# Altium schematic sheet power.SchDoc: Test
size A4; DrawnBy: Łukasz Przeniosło; Organization: Zachodniopomorski; Address1: Uniwersytet Technologiczny; Address2: w Szczecinie; Address3: Wydział Elektryczny; DocumentNumber: 8; Revision: 1.0; SheetNumber: 8; SheetTotal: 8
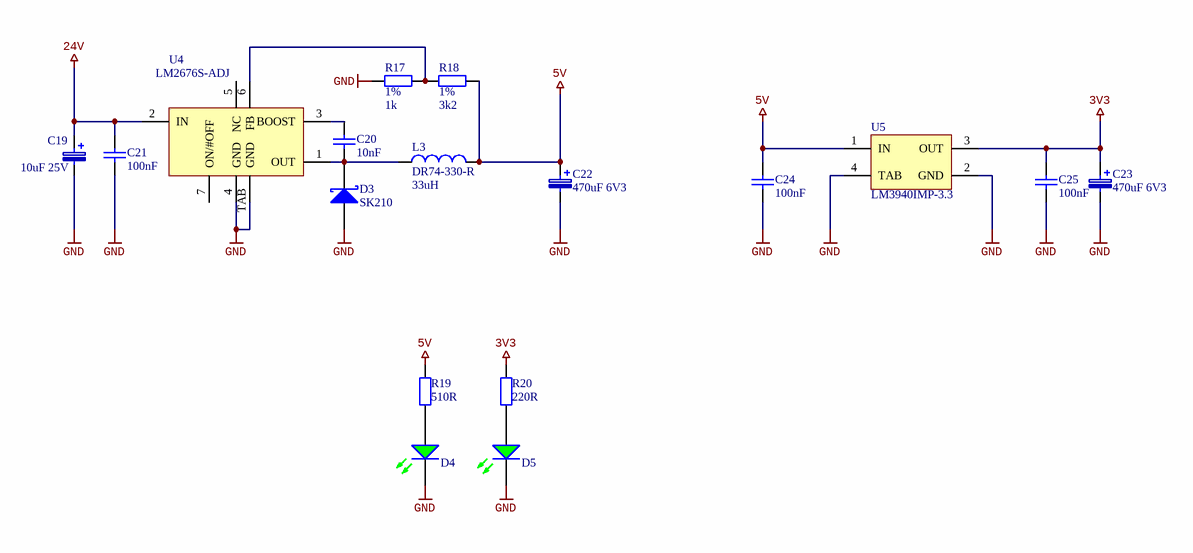
[diagram p0: power.SchDoc]

## Parts
C19  10uF 25V  [SMDB]
C20  10nF  [CAPC1608N]
C21  100nF  [CAPC1608N]
C22  470uF 6V3  [SMDD]
C23  470uF 6V3  [SMDD]
C24  100nF  [CAPC1608N]
C25  100nF  [CAPC1608N]
D3  SK210  [SMB]
D4  LL-S172GC-2A  [CD2012-0805]  (value not drawn)
D5  LL-S172GC-2A  [CD2012-0805]  (value not drawn)
L3  DR74-330-R  value 33uH  [DR74 Series]
R17  Tolerance: 1%  [RESC1608N]  (hidden comment: 1k)
R18  Tolerance: 1%  [RESC1608N]  (hidden comment: 3k2)
R19  510R  [RESC1608N]
R20  220R  [RESC1608N]
U4  LM2676S-ADJ  [TO-263-7]
U5  LM3940IMP-3.3  [MP04A_N]

## Nets
3V3: C23.1 C25.2 R20.1 U5.3(OUT)
5V: C22.1 C24.2 L3.2 R18.2 R19.1 U5.1(IN)
24V: C19.1 C21.2 U4.2(IN)
GND: C19.2 C21.1 C22.2 C23.2 C24.1 C25.1 D3.1(A) D4.2(K) D5.2(K) R17.1 U4.4(GND) U4.TAB(GND) U5.2(GND) U5.4(TAB)
NetC20_1: C20.1 D3.2(K) L3.1 U4.1(OUT)
NetC20_2: C20.2 U4.3(BOOST)
NetD4_1: D4.1(A) R19.2
NetD5_1: D5.1(A) R20.2
NetR17_2: R17.2 R18.1 U4.6(FB)

Not connected (* = marked no-connect by the designer): U4 5(NC) 7(ON/#OFF)

## Notes on the sheet
- Title
- Size:
- Date:
- A4
- Author:
- Time:
- Sheet
- of
- File:

## Library data of the parts
C19 = Capacitor Tantalum: Value: 10uF 25V
C20 C21 = Capacitor
  C20: Value: 10nF
  C21: Value: 100nF
C22 C23 = 10uF 35V-SMDD: Polarized Capacitor (Surface Mount); Value: 10uF; PackageReference: SMDD; Manufacturer: *; Manufacturer Part No.: *; Distributor: tme.pl; Distributor Order Code: TC 10/35-SMDD; tme.pl: TC 10/35-SMDD
C24 C25 = Cap: Capacitor; Published: 8-Jun-2000; LatestRevisionDate: 17-Jul-2002; LatestRevisionNote: Re-released for DXP Platform.; Publisher: Altium Limited
D3 = MBRS340T3: Schottky Barrier Rectifier,  40V, 3A; PackageReference: SMC; Distributor: *; Distributor Order Code: *; Manufacturer Part No.: *; tme.pl: MBRS340T3
D4 D5 = Led Green: Typical GREEN LED; Manufacturer: Lucky Light; Value: LL-S172GC-2A
L3 = DR74-330-R: elfa.se: 58-101-14; Published: 8-Jun-2000; PackageDocument: Sep-1998; Publisher: Altium Limited; ComponentLink1Description: Manufacturer Link; ComponentLink2Description: Datasheet; Distributor: tme.pl
R17 R18 = Resistor: Power: 0W
  R17: Value: 1k
  R18: Value: 3k2
R19 R20 = Resistor: Tolerance: 5%; Power: 0W
  R19: Value: 510R
  R20: Value: 220R
U4 = LM2676S-ADJ: SIMPLE SWITCHER High Efficiency 3A Step-Down Voltage Regulator; elfa.se: 73-068-81; ComponentLink1Description: Manufacturer Link; ComponentLink1URL: http://www.national.com/; ComponentLink2Description: Datasheet; ComponentLink2URL: http://www.national.com/ds.cgi/LM/LM2676.pdf; Distributor: tme.pl
U5 = LM3940IMP-3.3: 1A Low Dropout Regulator for 5V to 3.3V Conversion, 4-pin SOT-223; Manufacturer: National Semiconductor; PackageTopMarking: XYTT*L52B; PowerWise: N; CompType: LDO IC; Published: 4-Dec-2008; DatasheetVersion: Jul-2007; PackageVersion: revB, Apr-2003; PackageReference: MP04A; Publisher: Altium Limited; PackageDescription: Molded SOT-223, 6.50 x 3.56 x 1.6mm Body, 4 Lead, 2.3mm Pitch; Supplier 1: Farnell; Supplier Part Number 1: 9779280; PartNumber: LM3940IMP-3.3; RoHS: N; PinCount: 4; Code_JEDEC: TO-261-AA; Code_IPC: SOT223-4; ComponentLink1Description: LM3940 Datasheet; ComponentLink1URL: http://www.national.com/ds/LM/LM3940.pdf; ComponentLink2Description: LM3940 Web Page; ComponentLink2URL: http://www.national.com/pf/LM/LM3940.html; ComponentLink3Description: MP04A Package Page; ComponentLink3URL: http://www.national.com/packaging/folders/mp04a.html